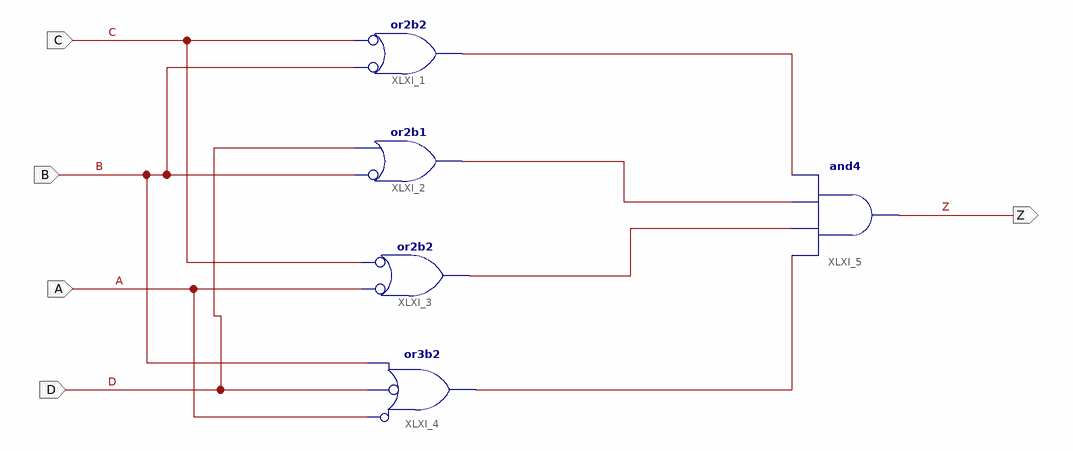
[diagram p0: schematic sheet 1]
// Xilinx ISE schematic p1ej2b.sch (spartan3) as structural Verilog: 5 symbols, 5 ports
module p1ej2b (
  input  D,
  input  C,
  input  B,
  input  A,
  output Z
);

  wire XLXN_1, XLXN_2, XLXN_3, XLXN_4;

  or XLXI_1 (XLXN_4, ~B, ~C);  // or2b2
  or XLXI_2 (XLXN_3, ~B, D);  // or2b1
  or XLXI_3 (XLXN_2, ~A, ~C);  // or2b2
  or XLXI_4 (XLXN_1, ~A, ~D, B);  // or3b2
  and XLXI_5 (Z, XLXN_1, XLXN_2, XLXN_3, XLXN_4);
endmodule
